# Altium schematic sheet ClkGeneration.SchDoc: Clocks
size 594 x 420 mm; CheckedBy: T.Janicki; CompanyName: Creotech Instruments SA; DrawnBy: G.Kasprowicz; Organization: CERN; Address1: European Organization for Nuclear Research; Address2: CH-1211 Genève 23 - Switzerland; Revision: -; SheetNumber: 9; SheetTotal: 11; EDA_Number: EDA-xxxx; Projet: Simple VME FMC Carrier; ModifiedBy: -; CreateDate: 20/11/2012; CheckedDate: 23/01/2012; DivGrp: BE-CO; Designer: G.Kasprowicz; PageSetup: Record=PageOptions|CenterHorizontal=True|CenterVertical=True|PrintScale=0.67|XCorrection=1.00|YCorrection=1.00|PrintKind=1|BorderSize=5000000|LeftOffset=0|BottomOffset=0|Orientation=2|PaperLength=1000|PaperWidth=1000|Scale=100|PaperSource=15|PrintQuality=600|MediaType=1|DitherType=10|PaperKind=A3|PrintScaleMode=1; ModifiedDate: -
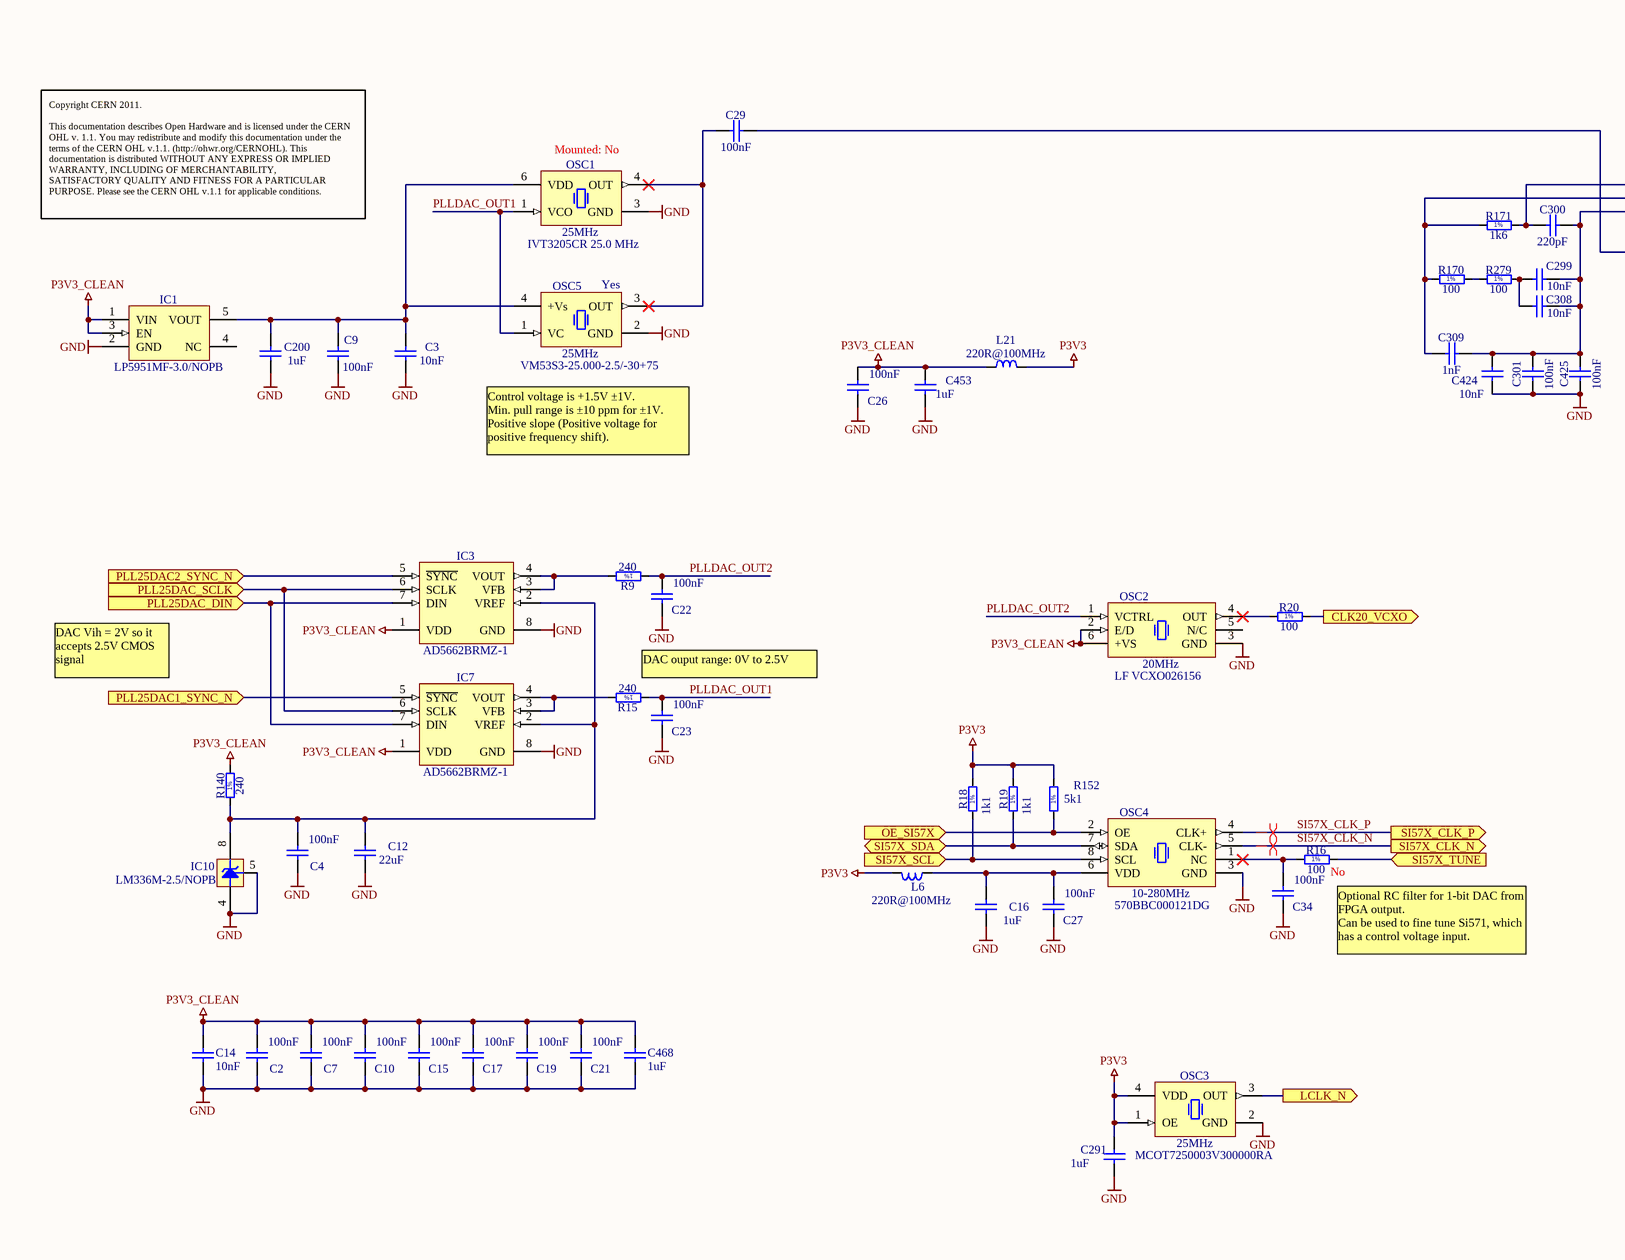
[diagram p0: ClkGeneration.SchDoc, left]
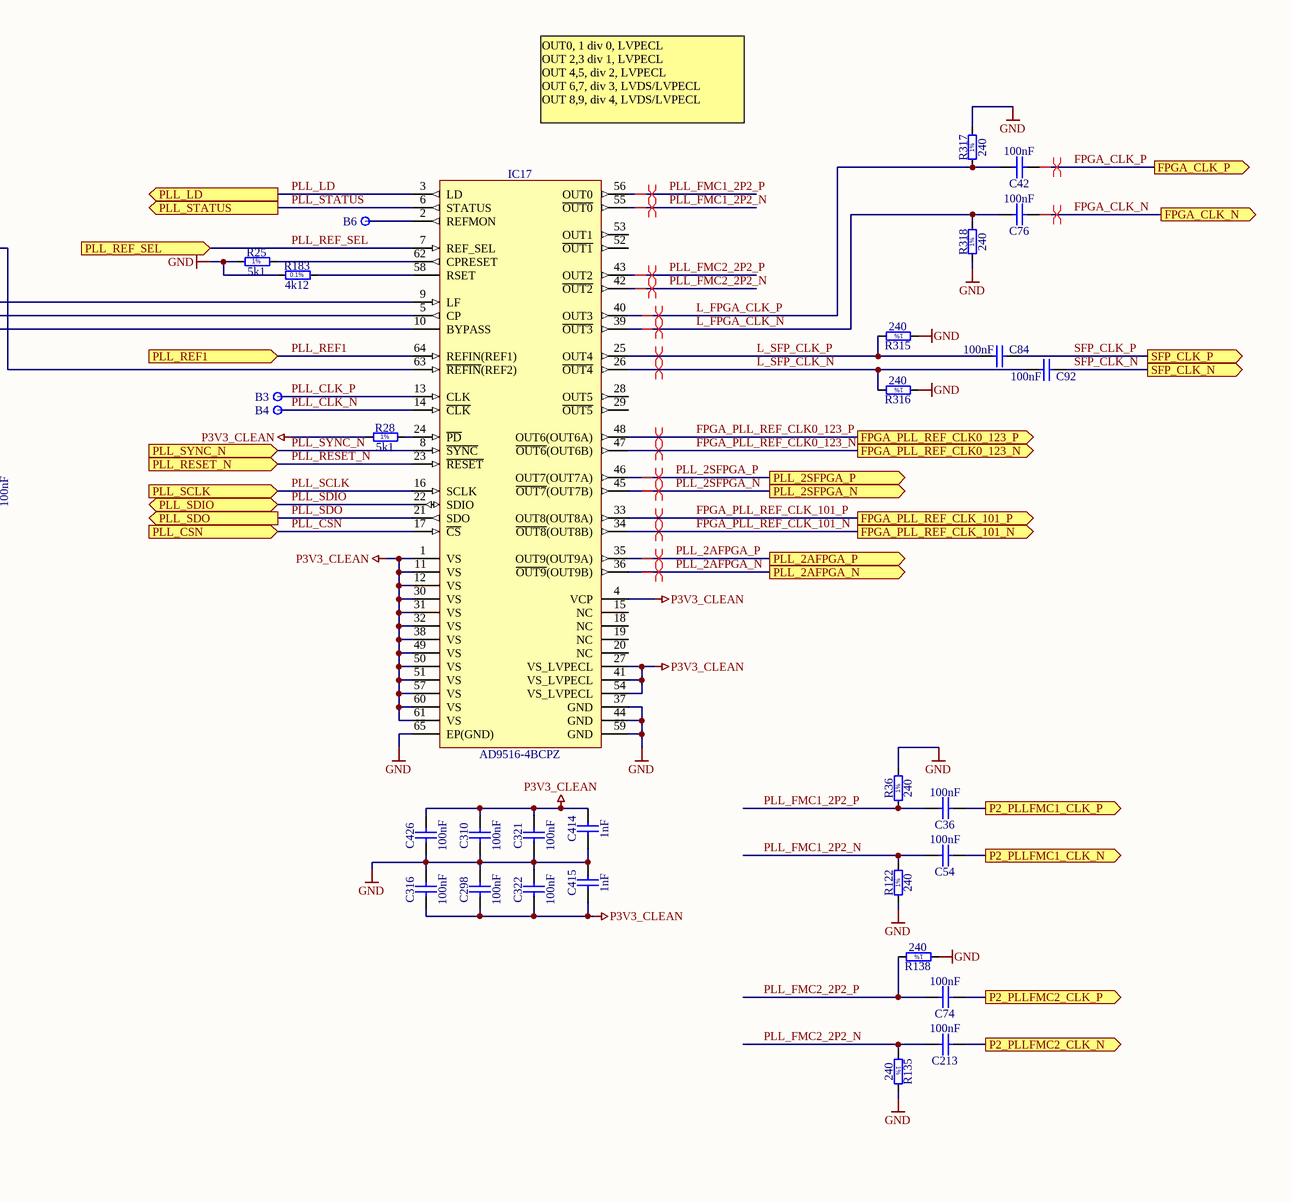
[diagram p1: ClkGeneration.SchDoc, right]

## Parts
B3  Plated Hole  [c130h80]  (value not drawn)
B4  Plated Hole  [c130h80]  (value not drawn)
B6  Plated Hole  [c130h80]  (value not drawn)
C2  100nF  [CAPC1005X55N]
C3  10nF  [CAPC1608X87N]
C4  100nF  [CAPC1005X55N]
C7  100nF  [CAPC1005X55N]
C9  100nF  [CAPC1005X55N]
C10  100nF  [CAPC1005X55N]
C12  22uF  [CAPC3216X180N]
C14  10nF  [CAPC1608X87N]
C15  100nF  [CAPC1005X55N]
C16  1uF  [CAPC1608X87N]
C17  100nF  [CAPC1005X55N]
C19  100nF  [CAPC1005X55N]
C21  100nF  [CAPC1005X55N]
C22  100nF  [CAPC1005X55N]
C23  100nF  [CAPC1005X55N]
C26  100nF  [CAPC1005X55N]
C27  100nF  [CAPC1005X55N]
C29  100nF  [CAPC1005X55N]
C34  100nF  [CAPC1005X55N]
C36  100nF  [CAPC1005X55N]
C42  100nF  [CAPC1005X55N]
C54  100nF  [CAPC1005X55N]
C74  100nF  [CAPC1005X55N]
C76  100nF  [CAPC1005X55N]
C84  100nF  [CAPC1005X55N]
C92  100nF  [CAPC1005X55N]
C200  1uF  [CAPC1608X87N]
C213  100nF  [CAPC1005X55N]
C291  1uF  [CAPC1608X87N]
C298  100nF  [CAPC1005X55N]
C299  10nF  [CAPC1005X55N]
C300  220pF  [CAPC1005X55N]
C301  100nF  [CAPC1005X55N]
C308  10nF  [CAPC1005X55N]
C309  1nF  [CAPC1005X55N]
C310  100nF  [CAPC1005X55N]
C316  100nF  [CAPC1005X55N]
C321  100nF  [CAPC1005X55N]
C322  100nF  [CAPC1005X55N]
C414  1nF  [CAPC1005X55N]
C415  1nF  [CAPC1005X55N]
C424  10nF  [CAPC1005X55N]
C425  100nF  [CAPC1005X55N]
C426  100nF  [CAPC1005X55N]
C453  1uF  [CAPC1608X87N]
C468  1uF  [CAPC1608X87N]
IC1  LP5951MF-3.0/NOPB  [SOT95P284X122-5N]
IC3  AD5662BRMZ-1  [SOP65P490X110-8N]
IC7  AD5662BRMZ-1  [SOP65P490X110-8N]
IC10  LM336M-2.5/NOPB  [SOIC127P600X175-8N]
IC17  AD9516-4BCPZ  [QFN50P900X900X100-65N-S635]
L6  220R@100MHz  [INDC2012X105N]
L21  220R@100MHz  [INDC2012X105N]
OSC1  25MHz  Manufacturer Part Number: IVT3205CR 25.0 MHz  Mounted: No  [OSC_RAKON_IVT3200C]
OSC2  20MHz  Manufacturer Part Number: LF VCXO026156  [OSC_IQD_CFPV-45]
OSC3  25MHz  Manufacturer Part Number: MCOT7250003V300000RA  [OSCSC508P500X700X160-4N]
OSC4  10-280MHz  Manufacturer Part Number: 570BBC000121DG  [OSC_SILICON-LAB_SI570]
OSC5  25MHz  Manufacturer Part Number: VM53S3-25.000-2.5/-30+75  Mounted: Yes  [OSCCC320X500X160-4N]
R9  240  [RESC1608X55N]
R15  240  [RESC1608X55N]
R16  100  Mounted: No  [RESC1608X55N]
R18  1k1  [RESC1608X55N]
R19  1k1  [RESC1608X55N]
R20  100  [RESC1608X55N]
R25  5k1  [RESC1608X55N]
R28  5k1  [RESC1608X55N]
R36  240  [RESC1608X55N]
R122  240  [RESC1608X55N]
R135  240  [RESC1608X55N]
R138  240  [RESC1608X55N]
R140  240  [RESC1608X55N]
R152  5k1  [RESC1608X55N]
R170  100  [RESC1608X55N]
R171  1k6  [RESC1608X55N]
R183  4k12  [RESC1608X55N]
R279  100  [RESC1608X55N]
R315  240  [RESC1608X55N]
R316  240  [RESC1608X55N]
R317  240  [RESC1608X55N]
R318  240  [RESC1608X55N]

## Ports
CLK20_VCXO (out), FPGA_CLK_N (out), FPGA_CLK_P (out), FPGA_PLL_REF_CLK0_123_N (out), FPGA_PLL_REF_CLK0_123_P (out), FPGA_PLL_REF_CLK_101_N (out), FPGA_PLL_REF_CLK_101_P (out), LCLK_N (out), OE_SI57X (in), P2_PLLFMC1_CLK_N (out), P2_PLLFMC1_CLK_P (out), P2_PLLFMC2_CLK_N (out), P2_PLLFMC2_CLK_P (out), PLL25DAC1_SYNC_N (in), PLL25DAC2_SYNC_N (in), PLL25DAC_DIN (in), PLL25DAC_SCLK (in), PLL_2AFPGA_N (out), PLL_2AFPGA_P (out), PLL_2SFPGA_N (out), PLL_2SFPGA_P (out), PLL_CSN (in), PLL_LD (out), PLL_REF1 (in), PLL_REF_SEL (in), PLL_RESET_N (in), PLL_SCLK (in), PLL_SDIO (bidir), PLL_SDO (out), PLL_STATUS (out), PLL_SYNC_N (in), SFP_CLK_N (out), SFP_CLK_P (out), SI57X_CLK_N (out), SI57X_CLK_P (out), SI57X_SCL (in), SI57X_SDA (bidir), SI57X_TUNE (in)

## Nets
GND: C2.1 C3.1 C4.1 C7.1 C9.1 C10.1 C12.1 C14.1 C15.1 C16.1 C17.1 C19.1 C21.1 C22.1 C23.1 C26.1 C27.1 C34.1 C200.1 C291.1 C298.2 C301.1 C310.1 C316.2 C321.1 C322.2 C414.1 C415.2 C424.1 C425.1 C426.1 C453.1 C468.1 IC1.2(GND) IC3.8(GND) IC7.8(GND) IC10.4(A) IC10.5(Adj) IC17.37(GND) IC17.44(GND) IC17.59(GND) IC17.65(EP(GND)) OSC1.3(GND) OSC2.3(GND) OSC3.2(GND) OSC4.3(GND) OSC5.2(GND) R25.1 R36.2 R122.1 R135.2 R138.1 R183.1 R315.1 R316.1 R317.2 R318.1
P3V3: C291.2 L6.2 L21.2 OSC3.1(OE) OSC3.4(VDD) R18.2 R19.2 R152.2
P3V3_CLEAN: C2.2 C7.2 C10.2 C14.2 C15.2 C17.2 C19.2 C21.2 C26.2 C298.1 C310.2 C316.1 C321.2 C322.1 C414.2 C415.1 C426.2 C453.2 C468.2 IC1.1(VIN) IC1.3(EN) IC3.1(VDD) IC7.1(VDD) IC17.1(VS) IC17.4(VCP) IC17.11(VS) IC17.12(VS) IC17.27(VS_LVPECL) IC17.30(VS) IC17.31(VS) IC17.32(VS) IC17.38(VS) IC17.41(VS_LVPECL) IC17.49(VS) IC17.50(VS) IC17.51(VS) IC17.54(VS_LVPECL) IC17.57(VS) IC17.60(VS) IC17.61(VS) L21.1 OSC2.2(E/D) OSC2.6(+VS) R28.1 R140.2
CLK20_VCXO: R20.2 ; port CLK20_VCXO
FPGA_CLK_N: C76.1 ; port FPGA_CLK_N
FPGA_CLK_P: C42.1 ; port FPGA_CLK_P
FPGA_PLL_REF_CLK0_123_N: IC17.47(~{OUT6}(OUT6B)) ; port FPGA_PLL_REF_CLK0_123_N
FPGA_PLL_REF_CLK0_123_P: IC17.48(OUT6(OUT6A)) ; port FPGA_PLL_REF_CLK0_123_P
FPGA_PLL_REF_CLK_101_N: IC17.34(~{OUT8}(OUT8B)) ; port FPGA_PLL_REF_CLK_101_N
FPGA_PLL_REF_CLK_101_P: IC17.33(OUT8(OUT8A)) ; port FPGA_PLL_REF_CLK_101_P
L_FPGA_CLK_N: C76.2 IC17.39(~{OUT3}) R318.2
L_FPGA_CLK_P: C42.2 IC17.40(OUT3) R317.1
L_SFP_CLK_N: C92.2 IC17.26(~{OUT4}) R316.2
L_SFP_CLK_P: C84.2 IC17.25(OUT4) R315.2
LCLK_N: OSC3.3(OUT) ; port LCLK_N
OE_SI57X: OSC4.2(OE) R152.1 ; port OE_SI57X
P2_PLLFMC1_CLK_N: C54.1 ; port P2_PLLFMC1_CLK_N
P2_PLLFMC1_CLK_P: C36.1 ; port P2_PLLFMC1_CLK_P
P2_PLLFMC2_CLK_N: C213.1 ; port P2_PLLFMC2_CLK_N
P2_PLLFMC2_CLK_P: C74.1 ; port P2_PLLFMC2_CLK_P
PLL25DAC1_SYNC_N: IC7.5(~{SYNC}) ; port PLL25DAC1_SYNC_N
PLL25DAC2_SYNC_N: IC3.5(~{SYNC}) ; port PLL25DAC2_SYNC_N
PLL25DAC_DIN: IC3.7(DIN) IC7.7(DIN) ; port PLL25DAC_DIN
PLL25DAC_SCLK: IC3.6(SCLK) IC7.6(SCLK) ; port PLL25DAC_SCLK
PLL_2AFPGA_N: IC17.36(~{OUT9}(OUT9B)) ; port PLL_2AFPGA_N
PLL_2AFPGA_P: IC17.35(OUT9(OUT9A)) ; port PLL_2AFPGA_P
PLL_2SFPGA_N: IC17.45(~{OUT7}(OUT7B)) ; port PLL_2SFPGA_N
PLL_2SFPGA_P: IC17.46(OUT7(OUT7A)) ; port PLL_2SFPGA_P
PLL_CLK_N: B4.1 IC17.14(~{CLK})
PLL_CLK_P: B3.1 IC17.13(CLK)
PLL_CSN: IC17.17(~{CS}) ; port PLL_CSN
PLL_FMC1_2P2_N: C54.2 IC17.55(~{OUT0}) R122.2
PLL_FMC1_2P2_P: C36.2 IC17.56(OUT0) R36.1
PLL_FMC2_2P2_N: C213.2 IC17.42(~{OUT2}) R135.1
PLL_FMC2_2P2_P: C74.2 IC17.43(OUT2) R138.2
PLL_LD: IC17.3(LD) ; port PLL_LD
PLL_REF1: IC17.64(REFIN(REF1)) ; port PLL_REF1
PLL_REF_SEL: IC17.7(REF_SEL) ; port PLL_REF_SEL
PLL_RESET_N: IC17.23(~{RESET}) ; port PLL_RESET_N
PLL_SCLK: IC17.16(SCLK) ; port PLL_SCLK
PLL_SDIO: IC17.22(SDIO) ; port PLL_SDIO
PLL_SDO: IC17.21(SDO) ; port PLL_SDO
PLL_STATUS: IC17.6(STATUS) ; port PLL_STATUS
PLL_SYNC_N: IC17.8(~{SYNC}) ; port PLL_SYNC_N
PLLDAC_OUT1: C23.2 OSC1.1(VCO) OSC5.1(VC) R15.1
PLLDAC_OUT2: C22.2 OSC2.1(VCTRL) R9.1
SFP_CLK_N: C92.1 ; port SFP_CLK_N
SFP_CLK_P: C84.1 ; port SFP_CLK_P
SI57X_CLK_N: OSC4.5(CLK-) ; port SI57X_CLK_N
SI57X_CLK_P: OSC4.4(CLK+) ; port SI57X_CLK_P
SI57X_SCL: OSC4.8(SCL) R18.1 ; port SI57X_SCL
SI57X_SDA: OSC4.7(SDA) R19.1 ; port SI57X_SDA
SI57X_TUNE: R16.2 ; port SI57X_TUNE
NetB6_1: B6.1 IC17.2(REFMON)
NetC3_2: C3.2 C9.2 C200.2 IC1.5(VOUT) OSC1.6(VDD) OSC5.4(+Vs)
NetC4_2: C4.2 C12.2 IC3.2(VREF) IC7.2(VREF) IC10.8(C) R140.1
NetC16_2: C16.2 C27.2 L6.1 OSC4.6(VDD)
NetC29_1: C29.1 OSC1.4(OUT) OSC5.3(OUT)
NetC29_2: C29.2 IC17.63(~{REFIN}(REF2))
NetC34_2: C34.2 OSC4.1(NC) R16.1
NetC299_1: C299.1 C308.1 R279.2
NetC299_2: C299.2 C300.2 C301.2 C308.2 C309.2 C424.2 C425.2 IC17.10(BYPASS)
NetC300_1: C300.1 IC17.9(LF) R171.2
NetC309_1: C309.1 IC17.5(CP) R170.1 R171.1
NetIC3_3: IC3.3(VFB) IC3.4(VOUT) R9.2
NetIC7_3: IC7.3(VFB) IC7.4(VOUT) R15.2
NetIC17_24: IC17.24(~{PD}) R28.2
NetIC17_58: IC17.58(RSET) R183.2
NetIC17_62: IC17.62(CPRESET) R25.2
NetOSC2_4: OSC2.4(OUT) R20.1
NetR170_2: R170.2 R279.1

Not connected (* = marked no-connect by the designer): IC1 4(NC); IC17 15(NC) 18(NC) 19(NC) 20(NC) 28(OUT5) 29(~{OUT5}) 52(~{OUT1}) 53(OUT1); OSC2 5(N/C)

## Layout directives
differential pair: FPGA_CLK_N, FPGA_CLK_P, FPGA_PLL_REF_CLK0_123_N, FPGA_PLL_REF_CLK0_123_P, FPGA_PLL_REF_CLK_101_N, FPGA_PLL_REF_CLK_101_P, L_FPGA_CLK_N, L_FPGA_CLK_P, L_SFP_CLK_N, L_SFP_CLK_P, PLL_2AFPGA_N, PLL_2AFPGA_P, PLL_2SFPGA_N, PLL_2SFPGA_P, PLL_FMC1_2P2_N, PLL_FMC1_2P2_P, PLL_FMC2_2P2_N, PLL_FMC2_2P2_P, SI57X_CLK_N, SI57X_CLK_P

## Notes on the sheet
- OUT0, 1 div 0, LVPECL
  OUT 2,3 div 1, LVPECL
  OUT 4,5, div 2, LVPECL
  OUT 6,7, div 3, LVDS/LVPECL
  OUT 8,9, div 4, LVDS/LVPECL
- Copyright CERN 2011.
  This documentation describes Open Hardware and is licensed under the CERN OHL v. 1.1. You may redistribute and modify this documentation under the terms of the CERN OHL v.1.1. (http://ohwr.org/CERNOHL). This documentation is distributed WITHOUT ANY EXPRESS OR IMPLIED WARRANTY, INCLUDING OF MERCHANTABILITY, SATISFACTORY QUALITY AND FITNESS FOR A PARTICULAR PURPOSE. Please see the CERN OHL v.1.1 for applicable conditions.
- Control voltage is +1.5V ±1V.
  Min. pull range is ±10 ppm for ±1V.
  Positive slope (Positive voltage for positive frequency shift).
- DAC Vih = 2V so it accepts 2.5V CMOS signal
- DAC ouput range: 0V to 2.5V
- (near R16) Optional RC filter for 1-bit DAC from FPGA output.
  Can be used to fine tune Si571, which has a control voltage input.
- Project/Equipment
- Document
- File
- Designer
- Drawn by
- Check.by
- Last Mod.
- Print Date
- Sheet
- Size
- A2
- of
- Rev
- (in symbol R0603_1K1_1%_0.1W_100PPM) 1%
- (in symbol R0603_1K6_1%_0.1W_100PPM) 1%
- (in symbol R0603_4K12_0.1%_0.063W_10PPM) 0.1%
- (in symbol R0603_5K1_1%_0.1W_100PPM) 1%
- (in symbol R0603_100R_1%_0.1W_100PPM) 1%
- (in symbol R0603_240R_1%_0.1W_100PPM) 1%

## Library data of the parts
B3 B4 B6 = PLATED_HOLE0.8_PAD1.3: Single Terminal Socket; Part Description: Plated Through Hole: Hole Dia.=0.8mm Pad Dia.=1.3mm; Mounted: No; Table: Pads; Part Number: PLATED_HOLE0.8_PAD1.3; Component Kind: Standard (No BOM); Component Type: Standard (No BOM); Pin Count: 1; Family: Plated Hole; Socket: No; SMD: No; Status: None; ComponentHeight: 0mm; Author: CERN DEM JLC; CreateDate: 2008-10-30; LatestRevisionDate: 2008-10-30; PackageDescription: Plated Through Hole: Hole Dia.=0.8mm Pad Dia.=1.3mm
C2 C4 C7 C9 C10 C15 C17 C19 C21-C23 C26 C27 C29 C34 C36 C42 C54 C74 C76 C84 C92 C213 C298 C301 C310 C316 C321 C322 C425 C426 = CC0402_100NF_16V_10%_X7R: Non-polarised capacitor; Part Description: SMD Multilayer Chip Ceramic Capacitor; Manufacturer: GENERIC; Manufacturer1 Part Number: 223878715649; Voltage: 16V; TC: X7R; Tolerance: ±10%; Table: Capacitors SMD; Part Number: CC0402_100NF_16V_10%_X7R; Component Kind: Standard; Component Type: Standard; Pin Count: 2; Value: 100nF; Status: Not Recommended; Manufacturer Part Number: CC0402_100NF_16V_10%_X7R; Case: 0402; Mounted: Yes; Socket: No; SMD: Yes; Manufacturer1 Example: PHYCOMP; Manufacturer1 ComponentHeight: 0.55mm; HelpURL: \\cern.ch\dfs\Applications\Altium\Datasheets\CC0402_X7R_PHYCOMP.pdf; Author: CERN DEM JLC
  C2 C4 C7 C9 C10 C15 C17 C19 C21-C23 C26 C27 C29 C34: CreateDate: 2007-12-03; LatestRevisionDate: 2007-12-03
  C36 C42 C54 C74 C76 C84 C92 C213 C298 C301 C310 C316 C321 C322 C425 C426: CreateDate: 03/12/2007; LatestRevisionDate: 03/12/2007
C3 C14 = CC0603_10NF_50V_10%_X7R: Non-polarised capacitor; Part Description: SMD Multilayer Chip Ceramic Capacitor; Manufacturer: GENERIC; Manufacturer1 Part Number: 223858615636; Voltage: 50V; TC: X7R; Tolerance: ±10%; Table: Capacitors SMD; Part Number: CC0603_10NF_50V_10%_X7R; Component Kind: Standard; Component Type: Standard; Pin Count: 2; Value: 10nF; Status: Preferred; Manufacturer Part Number: CC0603_10NF_50V_10%_X7R; Case: 0603; Mounted: Yes; Socket: No; SMD: Yes; Manufacturer1 Example: PHYCOMP; Manufacturer1 ComponentHeight: 0.87mm; HelpURL: \\cern.ch\dfs\Applications\Altium\Datasheets\CC0603_X7R_PHYCOMP.pdf; Author: CERN DEM JLC; CreateDate: 03/12/2007; LatestRevisionDate: 03/12/2007
C12 = CC1206_22UF_10V_10%_X7R: Non-polarised capacitor; Part Description: SMD Multilayer Chip Ceramic Capacitor; Manufacturer: GENERIC; Manufacturer1 Part Number: GRM31CR71A226KE15L; Voltage: 10V; TC: X7R; Tolerance: ±10%; Table: Capacitors SMD; Part Number: CC1206_22UF_10V_10%_X7R; Component Kind: Standard; Component Type: Standard; Pin Count: 2; Value: 22uF; Status: Preferred; Manufacturer Part Number: CC1206_22UF_10V_10%_X7R; Case: 1206; Mounted: Yes; Socket: No; SMD: Yes; Manufacturer1 Example: MURATA; Manufacturer1 ComponentHeight: 1.8mm; HelpURL: \\cern.ch\dfs\Applications\Altium\Datasheets\CC1206_X7R_MURATA_GRM-HI-CAP.pdf; Author: CERN DEM JLC; CreateDate: 2010-06-08; LatestRevisionDate: 2010-06-08
C16 C200 C291 C468 = CC0603_1UF_16V_10%_X7R: Non-polarised capacitor; Part Description: SMD Multilayer Chip Ceramic Capacitor; Manufacturer: GENERIC; Manufacturer1 Part Number: 223824613663; Voltage: 16V; TC: X7R; Tolerance: ±10%; Table: Capacitors SMD; Part Number: CC0603_1UF_16V_10%_X7R; Component Kind: Standard; Component Type: Standard; Pin Count: 2; Value: 1uF; Status: Preferred; Manufacturer Part Number: CC0603_1uF_16V_10%_X7R; Case: 0603; Mounted: Yes; Socket: No; SMD: Yes; Manufacturer1 Example: PHYCOMP; Manufacturer1 ComponentHeight: 0.87mm; HelpURL: \\cern.ch\dfs\Applications\Altium\Datasheets\CC0805_X5R_PHYCOMP_HC.pdf; Author: CERN DEM JLC
  C16 C200 C468: CreateDate: 03/12/2007; LatestRevisionDate: 03/12/2007
  C291: CreateDate: 12/3/2007; LatestRevisionDate: 12/3/2007
C299 C308 C424 = CC0402_10NF_16V_10%_X7R: Non-polarised capacitor; Part Description: SMD Multilayer Chip Ceramic Capacitor; Manufacturer: GENERIC; Manufacturer1 Part Number: 223878715636; Voltage: 16V; TC: X7R; Tolerance: ±10%; Table: Capacitors SMD; Part Number: CC0402_10NF_16V_10%_X7R; Component Kind: Standard; Component Type: Standard; Pin Count: 2; Value: 10nF; Status: Not Recommended; Manufacturer Part Number: CC0402_10NF_16V_10%_X7R; Case: 0402; Mounted: Yes; Socket: No; SMD: Yes; Manufacturer1 Example: PHYCOMP; Manufacturer1 ComponentHeight: 0.55mm; HelpURL: \\cern.ch\dfs\Applications\Altium\Datasheets\CC0402_X7R_PHYCOMP.pdf; Author: CERN DEM JLC; CreateDate: 2007-12-03; LatestRevisionDate: 2007-12-03
C300 = CC0402_220PF_50V_5%_NP0: Non-polarised capacitor; Part Description: SMD Multilayer Chip Ceramic Capacitor; Manufacturer: GENERIC; Manufacturer1 Part Number: 223886915221; Voltage: 50V; TC: NP0; Tolerance: ±5%; Table: Capacitors SMD; Part Number: CC0402_220PF_50V_5%_NP0; Component Kind: Standard; Component Type: Standard; Pin Count: 2; Value: 220pF; Status: Not Recommended; Manufacturer Part Number: CC0402_220PF_50V_5%_NP0; Case: 0402; Mounted: Yes; Socket: No; SMD: Yes; Manufacturer1 Example: PHYCOMP; Manufacturer1 ComponentHeight: 0.55mm; HelpURL: \\cern.ch\dfs\Applications\Altium\Datasheets\CC0402_NP0_PHYCOMP.pdf; Author: CERN DEM JLC; CreateDate: 03/12/2007; LatestRevisionDate: 03/12/2007
C309 C414 C415 = CC0402_1NF_50V_10%_X7R: Non-polarised capacitor; Part Description: SMD Multilayer Chip Ceramic Capacitor; Manufacturer: GENERIC; Manufacturer1 Part Number: 223858715623; Voltage: 50V; TC: X7R; Tolerance: ±10%; Table: Capacitors SMD; Part Number: CC0402_1NF_50V_10%_X7R; Component Kind: Standard; Component Type: Standard; Pin Count: 2; Value: 1nF; Status: Not Recommended; Manufacturer Part Number: CC0402_1NF_50V_10%_X7R; Case: 0402; Mounted: Yes; Socket: No; SMD: Yes; Manufacturer1 Example: PHYCOMP; Manufacturer1 ComponentHeight: 0.55mm; HelpURL: \\cern.ch\dfs\Applications\Altium\Datasheets\CC0402_X7R_PHYCOMP.pdf; Author: CERN DEM JLC; CreateDate: 03/12/2007; LatestRevisionDate: 03/12/2007
C453 = CC0603_1UF_16V_10%_X7R: Non-polarised capacitor; Part Description: SMD Multilayer Chip Ceramic Capacitor; Manufacturer: GENERIC; Manufacturer1 Part Number: 223824613663; Manufacturer1 Datasheet: \\cern.ch\dfs\Applications\Altium\Datasheets\CC0805_X5R_PHYCOMP_HC.pdf; Voltage: 16V; TC: X7R; Tolerance: ±10%; Table: Capacitors SMD; Part Number: CC0603_1UF_16V_10%_X7R; Component Kind: Standard; Component Type: Standard; Designator: Capacitor - non polarized; Library Reference: Capacitor - non polarized; Pin Count: 2; Value: 1uF; Status: Preferred; Manufacturer Part Number: CC0603_1uF_16V_10%_X7R; Case: 0603; Mounted: Yes; Socket: No; SMD: Yes; Manufacturer1 Example: PHYCOMP; Manufacturer1 ComponentHeight: 0.87mm; HelpURL: \\cern.ch\dfs\Applications\Altium\Datasheets\CC0805_X5R_PHYCOMP_HC.pdf; Author: CERN DEM JLC; CreateDate: 03/12/2007; LatestRevisionDate: 03/12/2007
IC1 = LP5951MF-3.0/NOPB: 150mA Micropower Low-Dropout CMOS Voltage Regulator; Part Description: 3V,  150mA Micropower Low-Dropout CMOS Voltage Regulator; Manufacturer: NATIONAL SEMICONDUCTOR; Table: Regulators; Part Number: LP5951MF-3.0/NOPB; Component Kind: Standard; Component Type: Standard; Device: LP5951MF-3.0/NOPB; PackageDescription: SOT23 5, Pitch 0.95mm - Body 1.67x2.99mm, IPC Medium Density; Manufacturer Part Number: LP5951MF-3.0/NOPB; Pin Count: 5; Case: SOT23-5; Mounted: Yes; Socket: No; SMD: Yes; ComponentHeight: 1.19mm; HelpURL: \\cern.ch\dfs\Applications\Altium\Datasheets\LP5951MF-3.0-NOPB.pdf; Author: CERN DEM JLC; CreateDate: 24/01/2011; LatestRevisionDate: 24/01/2011
IC3 IC7 = AD5662BRMZ-1: 2.7V to 5.5V, 250uA, Rail-to-Rail Output 16-Bit nanoDAC; Manufacturer: ANALOG DEVICES; Table: Analog & Interface; Part Number: AD5662BRMZ-1; Component Kind: Standard; Component Type: Standard; Device: AD5662BRMZ-1; PackageDescription: SOP, 8-Leads, Body 3.0x3.0mm, Pitch 0.65mm, IPC Medium Density; Part Description: 2.7V to 5.5V, 250uA, Rail-to-Rail Output 16-Bit nanoDAC; Manufacturer Part Number: AD5662BRMZ-1; Pin Count: 8; Case: MSOP8; Mounted: Yes; Socket: No; SMD: Yes; ComponentHeight: 1.1mm; Author: CERN DEM JLC; HelpURL: \\cern.ch\dfs\Applications\Altium\Datasheets\AD5662BRMZ-1.pdf; CreateDate: 1/10/2011; LatestRevisionDate: 1/10/2011
IC10 = LM336M-2.5/NOPB: Reference Diode; Part Description: 2.5V Voltage Reference Diode; Manufacturer: NATIONAL SEMICONDUCTOR; Table: Regulators; Part Number: LM336M-2.5/NOPB; Component Kind: Standard; Component Type: Standard; Device: LM336M-2.5/NOPB; PackageDescription: SOIC 8, Pitch 1.27mm - Body 4x5mm, IPC Medium Density; Manufacturer Part Number: LM336M-2.5/NOPB; Pin Count: 3; Case: SOIC8; Mounted: Yes; Socket: No; SMD: Yes; ComponentHeight: 1.75mm; HelpURL: \\cern.ch\dfs\Applications\Altium\Datasheets\LM336M-2.5-NOPB.pdf; Author: CERN DEM JLC; CreateDate: 2010-04-12; LatestRevisionDate: 2010-04-12
IC17 = AD9516-4BCPZ: 14-Output Clock Generator with Integrated 1.6 GHz VCO; Manufacturer: ANALOG DEVICES; Table: Logic; Part Number: AD9516-4BCPZ; Component Kind: Standard; Component Type: Standard; Device: AD9516-4BCPZ; PackageDescription: QFN,0.50mm pitch,square;64 pin,9.00mm L X 9.00mm W X 1.00mm H body (6.35mm X 6.35mm thermal tab), IPC Medium Density; Part Description: 14-Output Clock Generator with Integrated 1.6 GHz VCO; Manufacturer Part Number: AD9516-4BCPZ; Pin Count: 65; Case: QFN64; Mounted: Yes; Socket: No; SMD: Yes; ComponentHeight: 1.0mm; HelpURL: \\cern.ch\dfs\Applications\Altium\Datasheets\AD9516-4BCPZ.pdf; Author: CERN DEM JLC; CreateDate: 1/18/2010; LatestRevisionDate: 1/18/2010
L6 L21 = IND0805_MURATA_BLM21PG221SN1D: Inductor; Part Description: SMD EMIFIL Suppression Chip Bead Ferrite; Manufacturer: MURATA; Power: 2A; Resistance: 0.05R; Tolerance: ±25%; Table: Inductors SMD; Part Number: IND0805_MURATA_BLM21PG221SN1D; Component Kind: Standard; Component Type: Standard; Pin Count: 2; Value: 220R@100MHz; Status: None; Manufacturer Part Number: BLM21PG221SN1D; Case: 0805; Mounted: Yes; Socket: No; SMD: Yes; ComponentHeight: 1.05mm; HelpURL: \\cern.ch\dfs\Applications\Altium\Datasheets\IND0402_MURATA_BLM21P.pdf; Author: CERN DEM JLC; CreateDate: 25/01/2010; LatestRevisionDate: 25/01/2010
OSC1 = OSC_25MHZ_RAKON_IVT3205CR: Oscillator 4 pins 1=VCO 3=GND 4=OUT 6=VDC; Part Description: 11pF 3.3V ±1ppm Surface Mount TCXO Voltage Controlled Oscillator (IT3200C Serie); Manufacturer: RAKON; Table: Crystals & Oscillators; Part Number: OSC_25MHZ_RAKON_IVT3205CR; Component Kind: Standard; Component Type: Standard; PackageDescription: Oscillator IVT3200C Serie, corner concave; 4 pin, 2.50mm L X 3.2mm W X 1.1mm H; Value: 25MHz; Pin Count: 4; Socket: No; SMD: Yes; ComponentHeight: 1.1mm; HelpURL: \\cern.ch\dfs\Applications\Altium\Datasheets\OSC_RAKON_IVT3200C.pdf; Author: CERN DEM JLC; CreateDate: 08/02/2010; LatestRevisionDate: 08/02/2010
OSC2 = OSC_20MHZ_IQD_LF VCXO026156: 3.3V ±100ppm 15pF HCMOS Tri-State Surface Mount Voltage Controlled Oscillator VCXO (CFPV-45 Serie); Manufacturer: IQD FREQUENCY PRODUCTS; Table: Crystals & Oscillators; Part Number: OSC_20MHZ_IQD_LF VCXO026156; Component Kind: Standard; Component Type: Standard; PackageDescription: SMD VCXO, side convave, 6 pins, 5.00x7.00mm (CFPV-45 Serie); Value: 20MHz; Part Description: 3.3V ±100ppm 15pF HCMOS Tri-State Surface Mount Voltage Controlled Oscillator VCXO (CFPV-45 Serie); Pin Count: 6; Mounted: Yes; Socket: No; SMD: Yes; ComponentHeight: 1.7mm; HelpURL: \\cern.ch\dfs\Applications\Altium\Datasheets\OSC_IQD_CFPV-45.pdf; Author: CERN DEM JLC; CreateDate: 1/24/2011; LatestRevisionDate: 1/24/2011
OSC3 = OSC_25MHZ_MULTICOMP_MCOT7250003V300000RA: Oscillator 4 pins 1=OE 2=GND 3=OUT 4=VDD; Part Description: 3V3 ±100ppm 50pF  Tri-State Surface Mount MOS Clock Oscillator (OT7 Serie); Table: Crystals & Oscillators; Part Number: OSC_25MHZ_MULTICOMP_MCOT7250003V300000RA; Component Kind: Standard; Component Type: Standard; PackageDescription: SMD Oscillator, side convave, 4 pins, 5.00x7.00mm; Value: 25MHz; Manufacturer: MULTICOMP; Pin Count: 4; Mounted: Yes; Socket: No; SMD: Yes; ComponentHeight: 2mm; HelpURL: \\cern.ch\dfs\Applications\Altium\Datasheets\OSC_MULTICOMP_MCOT7.pdf; Author: CERN DEM JLC; CreateDate: 07/12/2010; LatestRevisionDate: 07/12/2010
OSC4 = OSC_10-280MHZ_SILICON-LAB_Si570BBC000121DG: Any-Rate I2C Programmable XO Oscillator Si570 Serie; Part Description: 10-280MHz 3.3V ±20ppm LVDS Any-Rate I2C Programmable XO Oscillator Si570 Serie; Manufacturer: SILICON LABS; Table: Crystals & Oscillators; Part Number: OSC_10-280MHZ_SILICON-LAB_Si570BBC000121DG; Component Kind: Standard; Component Type: Standard; PackageDescription: Oscillator Si570 Serie, 8 pins, 5x7mm; Value: 10-280MHz; Pin Count: 8; Mounted: Yes; Socket: No; SMD: Yes; ComponentHeight: 1.85mm; HelpURL: \\cern.ch\dfs\Applications\Altium\Datasheets\OSC_SILICON-LAB_SI570.pdf; Author: CERN DEM JLC; CreateDate: 2/9/2010; LatestRevisionDate: 2/9/2010
OSC5 = OSC_25MHZ_MERCURY_VM53S3-25.000-2.5/-30+75: Oscillator 4 pins 1=VC 2=GND 3=OUT 4=+Vs; Part Description: 3V ±2.5ppmVoltage Controlled Temperature Compensated Crystal Oscillator VM53S3 Serie; Manufacturer: MERCURY ELECTRONICS; Table: Crystals & Oscillators; Part Number: OSC_25MHZ_MERCURY_VM53S3-25.000-2.5/-30+75; Component Kind: Standard; Component Type: Standard; PackageDescription: SMD Oscillator, Corner Convave, 4 pins, 5x3.2mm; Value: 25MHz; Pin Count: 4; Socket: No; SMD: Yes; ComponentHeight: 1.6mm; HelpURL: \\cern.ch\dfs\Applications\Altium\Datasheets\OSC_MERCURY_VM53S3.pdf; Author: CERN DEM JLC; CreateDate: 1/20/2010; LatestRevisionDate: 1/24/2011
R9 R15 R36 R122 R135 R138 R140 R315-R318 = R0603_240R_1%_0.1W_100PPM: Resistor - 1%; Part Description: General Purpose Thick Film Chip Resistor; Manufacturer: GENERIC; Manufacturer1 Part Number: NRC06F2400TRF; Power: 0.1W; TC: ±100ppm/°C; Table: Resistors SMD; Part Number: R0603_240R_1%_0.1W_100PPM; Component Kind: Standard; Component Type: Standard; Pin Count: 2; Value: 240; Status: Preferred; Tolerance: ±1%; Manufacturer Part Number: R0603_240R_1%_0.1W_100PPM; Case: 0603; Mounted: Yes; Socket: No; SMD: Yes; Manufacturer1 Example: NIC COMPONENT; Manufacturer1 ComponentHeight: 0.55mm; HelpURL: \\cern.ch\dfs\Applications\Altium\Datasheets\R0603_NIC_NRC.pdf; Author: CERN DEM JLC; CreateDate: 12/3/2007; LatestRevisionDate: 3/13/2008
R16 R20 R170 R279 = R0603_100R_1%_0.1W_100PPM: Resistor - 1%; Part Description: General Purpose Thick Film Chip Resistor; Manufacturer: GENERIC; Manufacturer1 Part Number: NRC06F4700TRF; Power: 0.1W; TC: ±100ppm/°C; Table: Resistors SMD; Part Number: R0603_100R_1%_0.1W_100PPM; Component Kind: Standard; Component Type: Standard; Pin Count: 2; Value: 100; Status: Preferred; Tolerance: ±1%; Manufacturer Part Number: R0603_100R_1%_0.1W_100PPM; Case: 0603; Socket: No; SMD: Yes; Manufacturer1 Example: NIC COMPONENT; Manufacturer1 ComponentHeight: 0.55mm; HelpURL: \\cern.ch\dfs\Applications\Altium\Datasheets\R0603_NIC_NRC.pdf; Author: CERN DEM JLC; CreateDate: 2007-12-03; LatestRevisionDate: 2008-03-13
  R20 R170 R279: Mounted: Yes
R18 R19 = R0603_1K1_1%_0.1W_100PPM: Resistor - 1%; Part Description: General Purpose Thick Film Chip Resistor; Manufacturer: GENERIC; Manufacturer1 Part Number: NRC06F1101TRF; Power: 0.1W; TC: ±100ppm/°C; Table: Resistors SMD; Part Number: R0603_1K1_1%_0.1W_100PPM; Component Kind: Standard; Component Type: Standard; Pin Count: 2; Value: 1k1; Status: Preferred; Tolerance: ±1%; Manufacturer Part Number: R0603_1K1_1%_0.1W_100PPM; Case: 0603; Mounted: Yes; Socket: No; SMD: Yes; Manufacturer1 Example: NIC COMPONENT; Manufacturer1 ComponentHeight: 0.55mm; HelpURL: \\cern.ch\dfs\Applications\Altium\Datasheets\R0603_NIC_NRC.pdf; Author: CERN DEM JLC; CreateDate: 2007-12-03; LatestRevisionDate: 2008-03-13
R25 R28 R152 = R0603_5K1_1%_0.1W_100PPM: Resistor - 1%; Part Description: General Purpose Thick Film Chip Resistor; Manufacturer: GENERIC; Manufacturer1 Part Number: NRC06F5101TRF; Power: 0.1W; TC: ±100ppm/°C; Table: Resistors SMD; Part Number: R0603_5K1_1%_0.1W_100PPM; Component Kind: Standard; Component Type: Standard; Pin Count: 2; Value: 5k1; Status: Preferred; Tolerance: ±1%; Manufacturer Part Number: R0603_5K1_1%_0.1W_100PPM; Case: 0603; Mounted: Yes; Socket: No; SMD: Yes; Manufacturer1 Example: NIC COMPONENT; Manufacturer1 ComponentHeight: 0.55mm; HelpURL: \\cern.ch\dfs\Applications\Altium\Datasheets\R0603_NIC_NRC.pdf; Author: CERN DEM JLC
  R25 R28: CreateDate: 2007-12-03; LatestRevisionDate: 2008-03-13
  R152: CreateDate: 03/12/2007; LatestRevisionDate: 13/03/2008
R171 = R0603_1K6_1%_0.1W_100PPM: Resistor - 1%; Part Description: General Purpose Thick Film Chip Resistor; Manufacturer: GENERIC; Manufacturer1 Part Number: NRC06F1601TRF; Power: 0.1W; TC: ±100ppm/°C; Table: Resistors SMD; Part Number: R0603_1K6_1%_0.1W_100PPM; Component Kind: Standard; Component Type: Standard; Pin Count: 2; Value: 1k6; Status: Preferred; Tolerance: ±1%; Manufacturer Part Number: R0603_1K6_1%_0.1W_100PPM; Case: 0603; Mounted: Yes; Socket: No; SMD: Yes; Manufacturer1 Example: NIC COMPONENT; Manufacturer1 ComponentHeight: 0.55mm; HelpURL: \\cern.ch\dfs\Applications\Altium\Datasheets\R0603_NIC_NRC.pdf; Author: CERN DEM JLC; CreateDate: 2007-12-03; LatestRevisionDate: 2008-03-13
R183 = R0603_4K12_0.1%_0.063W_10PPM: Resistor - 0.1%; Part Description: Thin Film Chip Resistor; Manufacturer: GENERIC; Manufacturer1 Part Number: RN73C1J4K12BTDF; Power: 0.063W; TC: ±10ppm; Table: Resistors SMD; Part Number: R0603_4K12_0.1%_0.063W_10PPM; Component Kind: Standard; Component Type: Standard; Pin Count: 2; Value: 4k12; Status: Not recommended; Tolerance: ±0.1%; Manufacturer Part Number: R0603_4K12_0.1%_0.063W_10PPM; Case: 0603; Mounted: Yes; Socket: No; SMD: Yes; Manufacturer1 Example: TYCO HOLSWORTHY; Manufacturer1 ComponentHeight: 0.5mm; HelpURL: \\cern.ch\dfs\Applications\Altium\Datasheets\R0603_Tyco_RN73.pdf; Author: CERN DEM JLC; CreateDate: 03/12/2007; LatestRevisionDate: 13/03/2008